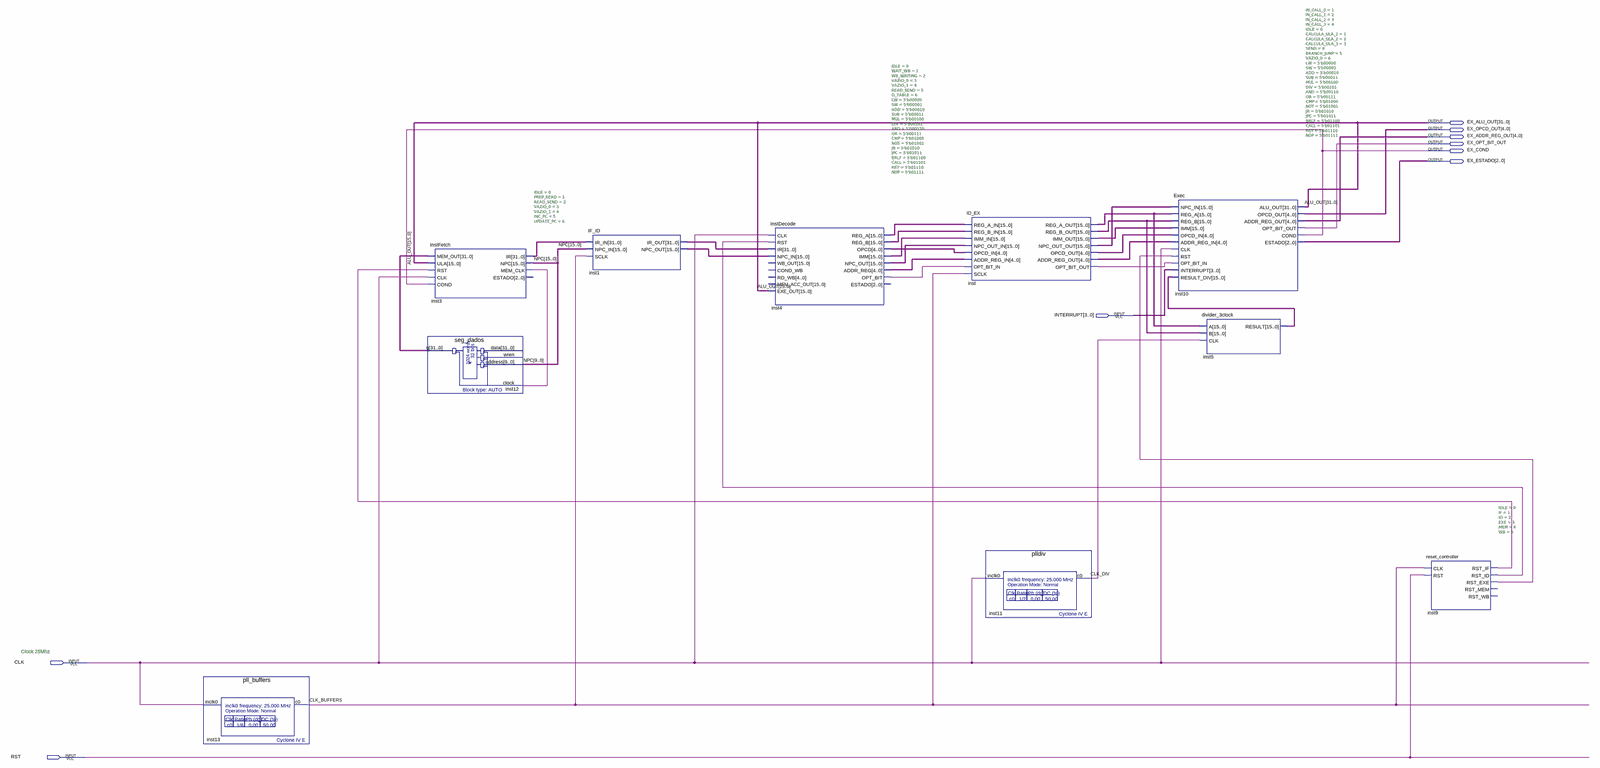
[diagram p0: schematic sheet, whole]
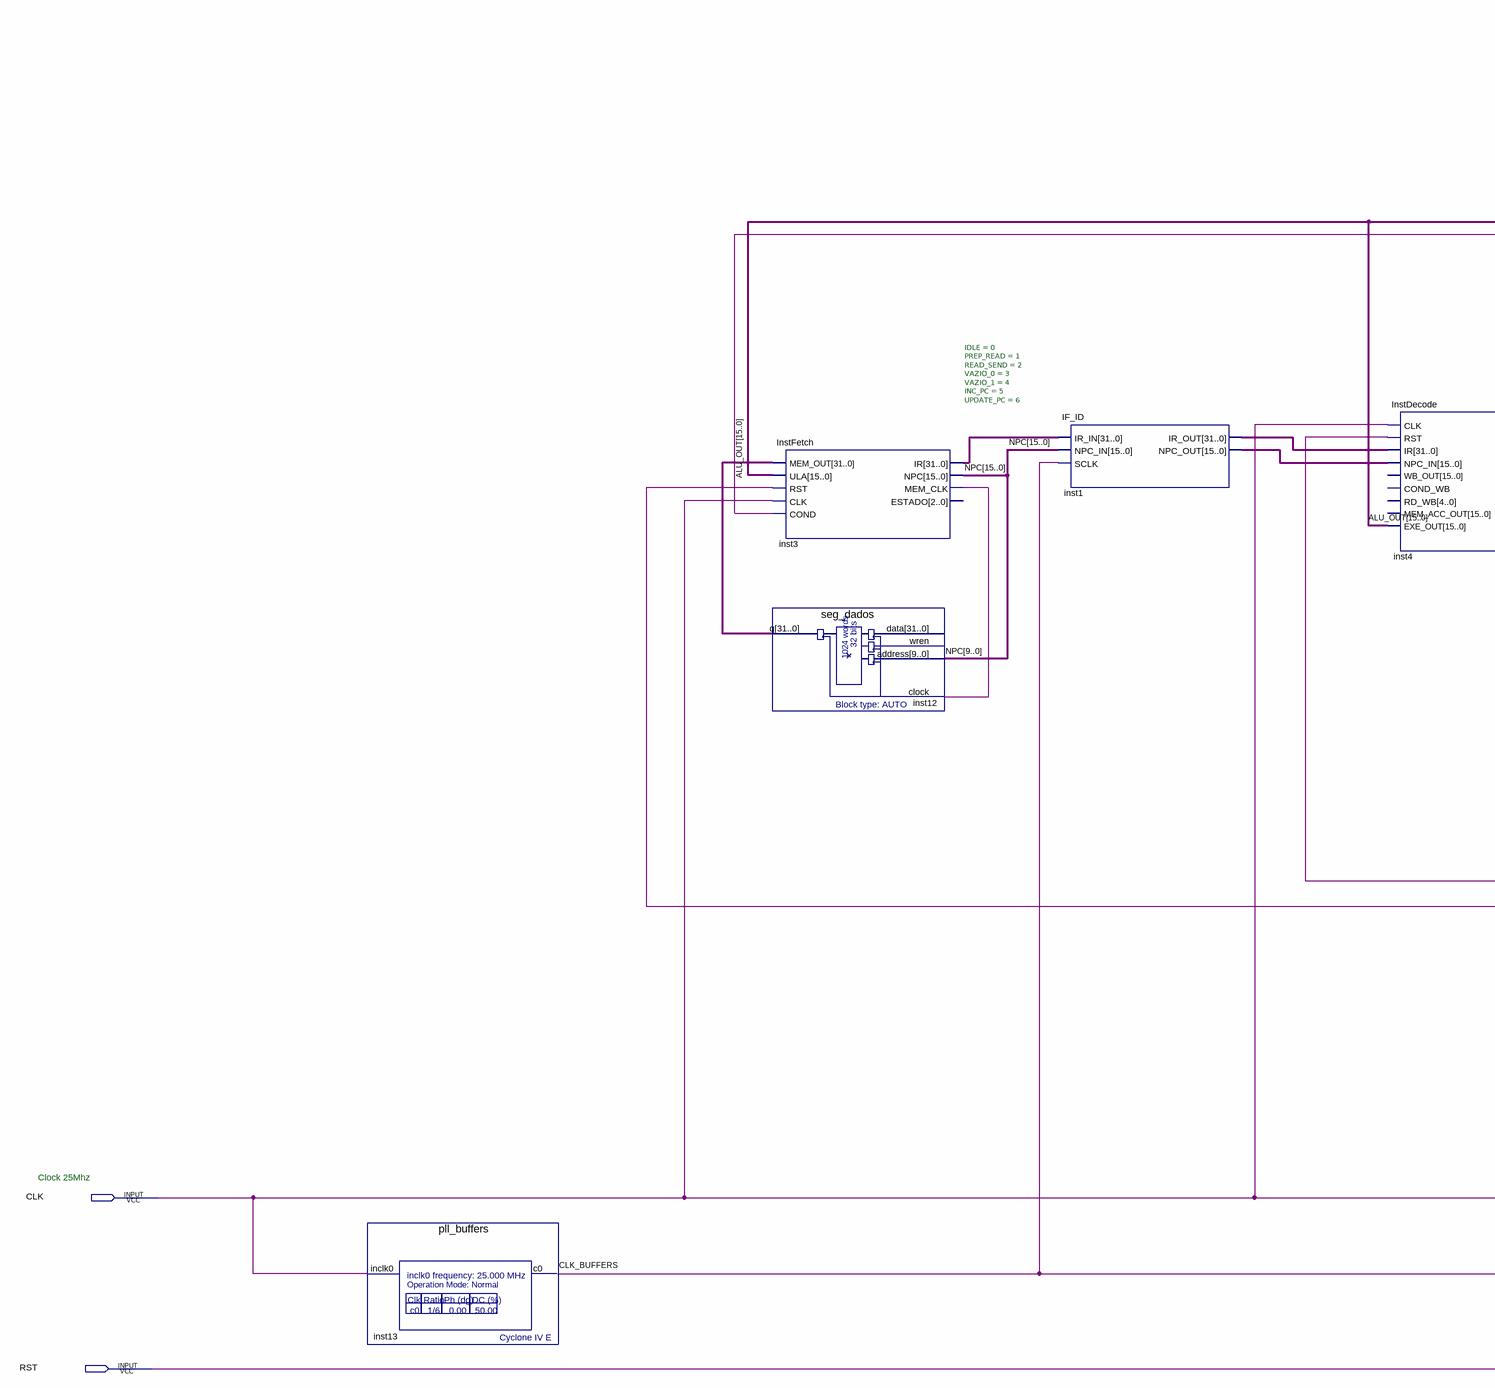
[diagram p1: schematic sheet, left part]
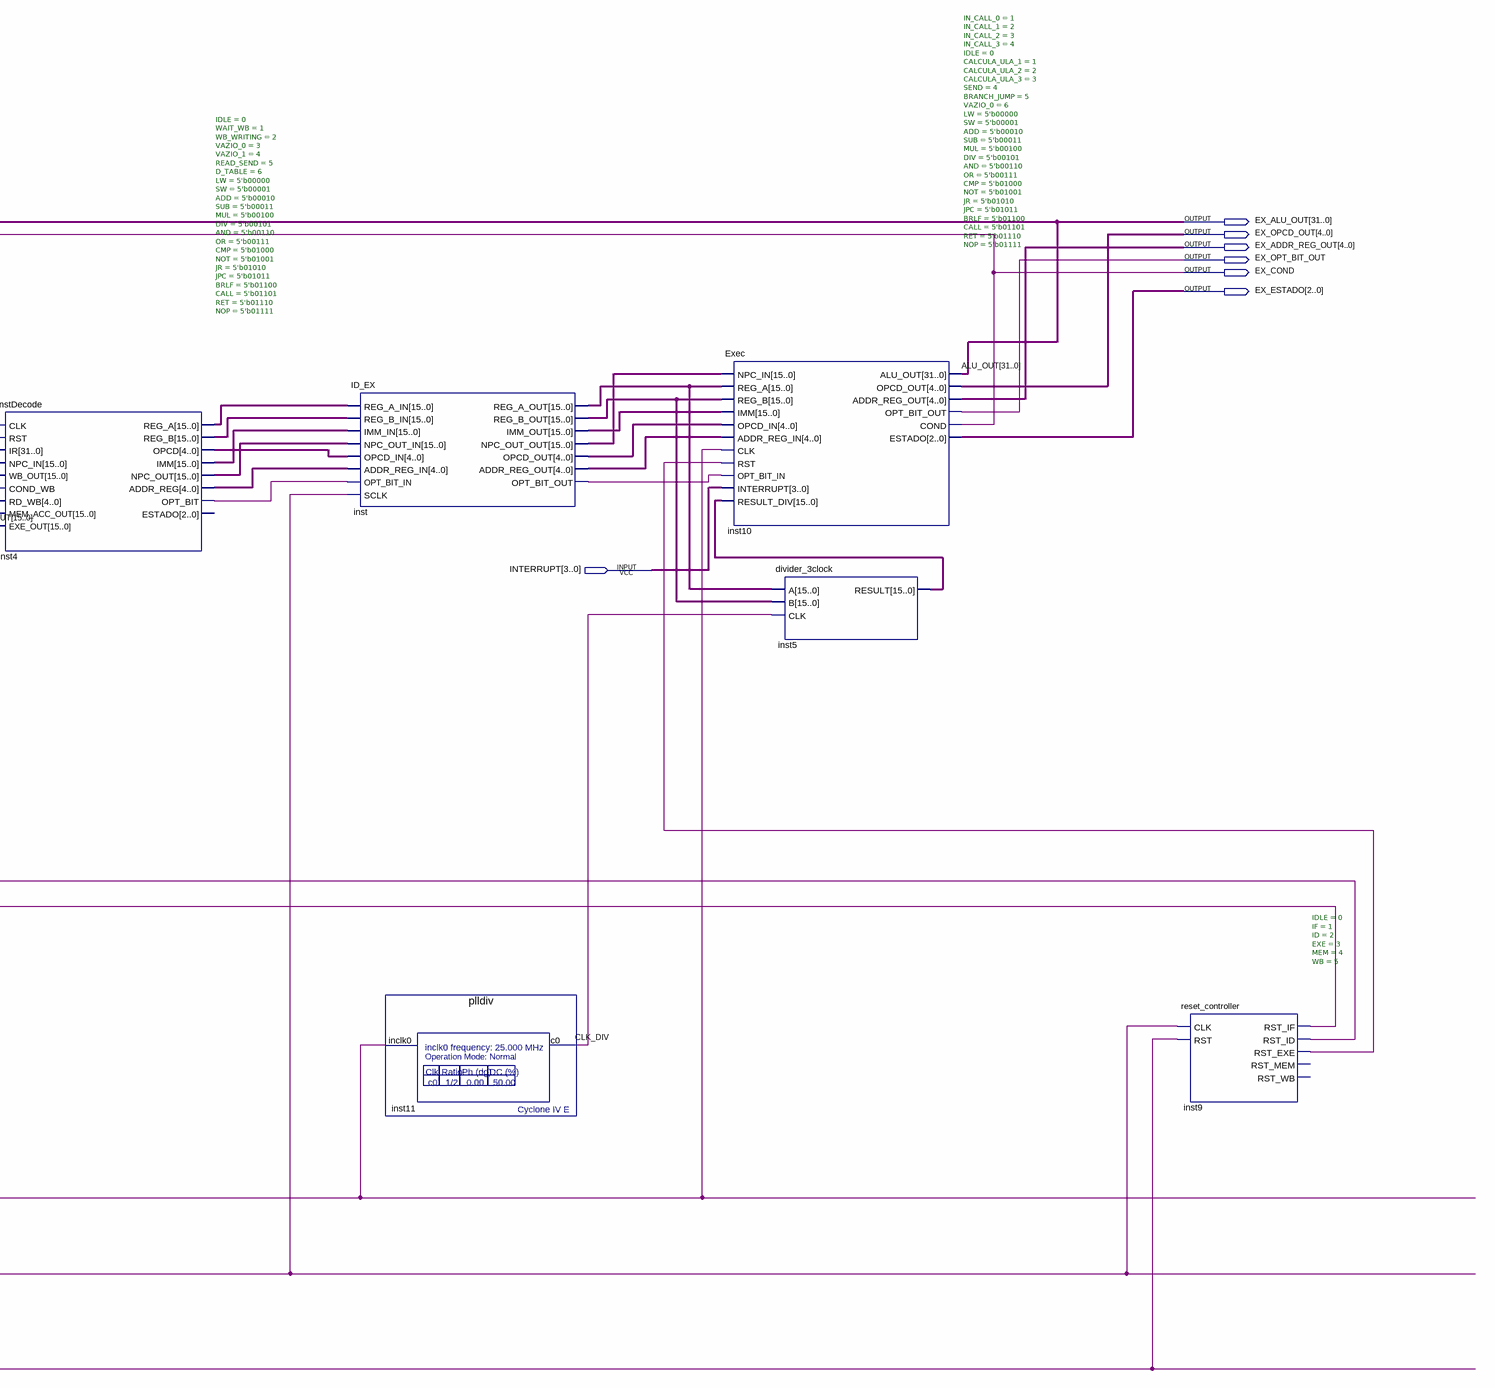
[diagram p2: schematic sheet, right part]
// Quartus schematic Exec_block_.bdf as structural Verilog: 10 symbols, 9 pins
module Exec_block_ (
  input  [3:0] INTERRUPT,
  input  CLK,
  input  RST,
  output [31:0] EX_ALU_OUT,
  output [4:0] EX_OPCD_OUT,
  output [4:0] EX_ADDR_REG_OUT,
  output EX_OPT_BIT_OUT,
  output EX_COND,
  output [2:0] EX_ESTADO
);

  wire CLK_BUFFERS, CLK_DIV, inst3_mem_clk, inst4_opt_bit, inst9_rst_exe, inst9_rst_id, inst9_rst_if,
       inst_opt_bit_out;
  wire [4:0] inst4_addr_reg, inst4_opcd, inst_addr_reg_out, inst_opcd_out;
  wire [15:0] inst1_npc_out, inst4_imm, inst4_npc_out, inst4_reg_a, inst4_reg_b, inst5_result, inst_imm_out,
       inst_npc_out_out, inst_reg_a_out, inst_reg_b_out, NPC;
  wire [31:0] inst1_ir_out, inst3_ir, inst12_q;

  pll_buffers inst13 (.inclk0(CLK), .c0(CLK_BUFFERS));
  InstFetch #(.IDLE(0), .PREP_READ(1), .READ_SEND(2), .VAZIO_0(3), .VAZIO_1(4), .INC_PC(5), .UPDATE_PC(6)) inst3 (
    .MEM_OUT(inst12_q), .ULA(EX_ALU_OUT[15:0]), .RST(inst9_rst_if), .CLK(CLK), .COND(EX_COND), .IR(inst3_ir),
    .NPC(NPC), .MEM_CLK(inst3_mem_clk));  // open: ESTADO
  seg_dados inst12 (.address(NPC[9:0]), .clock(inst3_mem_clk), .q(inst12_q));  // open: data, wren
  IF_ID inst1 (.IR_IN(inst3_ir), .NPC_IN(NPC), .SCLK(CLK_BUFFERS), .IR_OUT(inst1_ir_out), .NPC_OUT(inst1_npc_out));
  InstDecode #(.IDLE(0), .WAIT_WB(1), .WB_WRITING(2), .VAZIO_0(3), .VAZIO_1(4), .READ_SEND(5), .D_TABLE(6), .LW(5'b00000), .SW(5'b00001), .ADD(5'b00010), .SUB(5'b00011), .MUL(5'b00100), .DIV(5'b00101), .AND(5'b00110), .OR(5'b00111), .CMP(5'b01000), .NOT(5'b01001), .JR(5'b01010), .JPC(5'b01011), .BRLF(5'b01100), .CALL(5'b01101), .RET(5'b01110), .NOP(5'b01111)) inst4 (
    .CLK(CLK), .RST(inst9_rst_id), .IR(inst1_ir_out), .NPC_IN(inst1_npc_out), .EXE_OUT(EX_ALU_OUT[15:0]),
    .REG_A(inst4_reg_a), .REG_B(inst4_reg_b), .OPCD(inst4_opcd), .IMM(inst4_imm), .NPC_OUT(inst4_npc_out),
    .ADDR_REG(inst4_addr_reg), .OPT_BIT(inst4_opt_bit));  // open: WB_OUT, COND_WB, RD_WB, MEM_ACC_OUT, ESTADO
  ID_EX inst (
    .REG_A_IN(inst4_reg_a), .REG_B_IN(inst4_reg_b), .IMM_IN(inst4_imm), .NPC_OUT_IN(inst4_npc_out),
    .OPCD_IN(inst4_opcd), .ADDR_REG_IN(inst4_addr_reg), .OPT_BIT_IN(inst4_opt_bit), .SCLK(CLK_BUFFERS),
    .REG_A_OUT(inst_reg_a_out), .REG_B_OUT(inst_reg_b_out), .IMM_OUT(inst_imm_out),
    .NPC_OUT_OUT(inst_npc_out_out), .OPCD_OUT(inst_opcd_out), .ADDR_REG_OUT(inst_addr_reg_out),
    .OPT_BIT_OUT(inst_opt_bit_out));
  plldiv inst11 (.inclk0(CLK), .c0(CLK_DIV));
  Exec #(.IN_CALL_0(1), .IN_CALL_1(2), .IN_CALL_2(3), .IN_CALL_3(4), .IDLE(0), .CALCULA_ULA_1(1), .CALCULA_ULA_2(2), .CALCULA_ULA_3(3), .SEND(4), .BRANCH_JUMP(5), .VAZIO_0(6), .LW(5'b00000), .SW(5'b00001), .ADD(5'b00010), .SUB(5'b00011), .MUL(5'b00100), .DIV(5'b00101), .AND(5'b00110), .OR(5'b00111), .CMP(5'b01000), .NOT(5'b01001), .JR(5'b01010), .JPC(5'b01011), .BRLF(5'b01100), .CALL(5'b01101), .RET(5'b01110), .NOP(5'b01111)) inst10 (
    .NPC_IN(inst_npc_out_out), .REG_A(inst_reg_a_out), .REG_B(inst_reg_b_out), .IMM(inst_imm_out),
    .OPCD_IN(inst_opcd_out), .ADDR_REG_IN(inst_addr_reg_out), .CLK(CLK), .RST(inst9_rst_exe),
    .OPT_BIT_IN(inst_opt_bit_out), .INTERRUPT(INTERRUPT), .RESULT_DIV(inst5_result), .ALU_OUT(EX_ALU_OUT),
    .OPCD_OUT(EX_OPCD_OUT), .ADDR_REG_OUT(EX_ADDR_REG_OUT), .OPT_BIT_OUT(EX_OPT_BIT_OUT), .COND(EX_COND),
    .ESTADO(EX_ESTADO));
  divider_3clock inst5 (.A(inst_reg_a_out), .B(inst_reg_b_out), .CLK(CLK_DIV), .RESULT(inst5_result));
  reset_controller #(.IDLE(0), .IF(1), .ID(2), .EXE(3), .MEM(4), .WB(5)) inst9 (
    .CLK(CLK_BUFFERS), .RST(RST), .RST_IF(inst9_rst_if), .RST_ID(inst9_rst_id), .RST_EXE(inst9_rst_exe));  // open: RST_MEM, RST_WB

  // Other names for the same wires on the sheet: ALU_OUT[31:0] = EX_ALU_OUT

  // Notes on the sheet:
  //   Clock 25Mhz
endmodule
